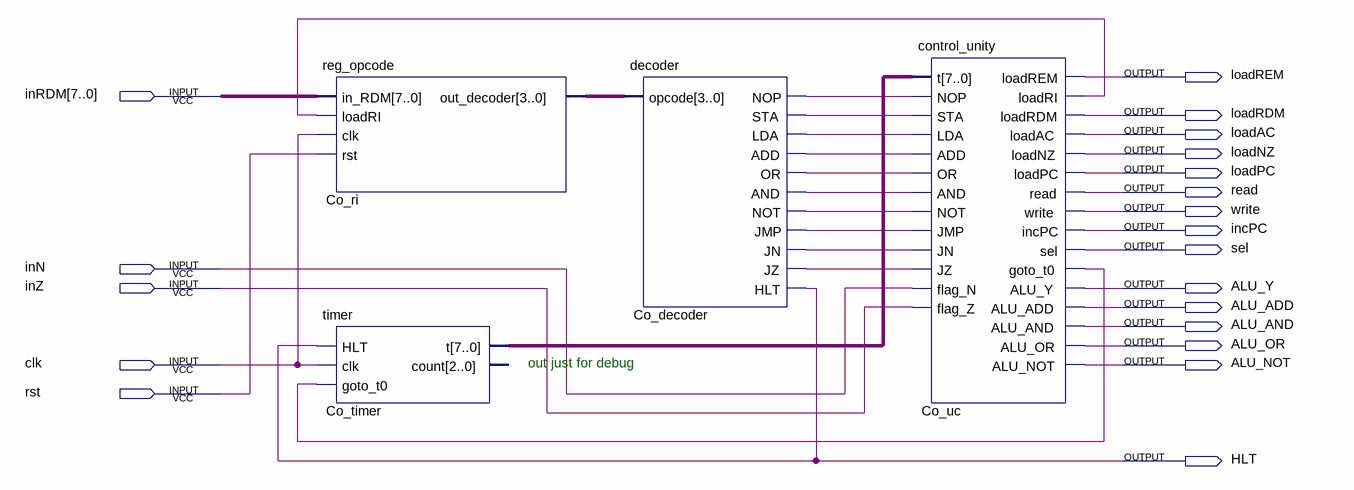
[diagram p0: schematic sheet]
// Quartus schematic mega_cu.bdf as structural Verilog: 4 symbols, 20 pins
module mega_cu (
  input  [7:0] inRDM,
  input  inN,
  input  inZ,
  input  clk,
  input  rst,
  output loadREM,
  output loadRDM,
  output loadAC,
  output loadNZ,
  output loadPC,
  output read,
  output write,
  output incPC,
  output sel,
  output ALU_Y,
  output ALU_ADD,
  output ALU_AND,
  output ALU_OR,
  output ALU_NOT,
  output HLT
);

  wire Co_decoder_add, Co_decoder_and, Co_decoder_jmp, Co_decoder_jn, Co_decoder_jz, Co_decoder_lda,
       Co_decoder_nop, Co_decoder_not, Co_decoder_or, Co_decoder_sta, Co_uc_goto_t0, Co_uc_loadri;
  wire [3:0] Co_ri_out_decoder;
  wire [7:0] Co_timer_t;

  reg_opcode Co_ri (.in_RDM(inRDM), .loadRI(Co_uc_loadri), .clk(clk), .rst(rst), .out_decoder(Co_ri_out_decoder));
  timer Co_timer (.HLT(HLT), .clk(clk), .goto_t0(Co_uc_goto_t0), .t(Co_timer_t));  // open: count
  decoder Co_decoder (
    .opcode(Co_ri_out_decoder), .NOP(Co_decoder_nop), .STA(Co_decoder_sta), .LDA(Co_decoder_lda),
    .ADD(Co_decoder_add), .OR(Co_decoder_or), .AND(Co_decoder_and), .NOT(Co_decoder_not),
    .JMP(Co_decoder_jmp), .JN(Co_decoder_jn), .JZ(Co_decoder_jz), .HLT(HLT));
  control_unity Co_uc (
    .t(Co_timer_t), .NOP(Co_decoder_nop), .STA(Co_decoder_sta), .LDA(Co_decoder_lda), .ADD(Co_decoder_add),
    .OR(Co_decoder_or), .AND(Co_decoder_and), .NOT(Co_decoder_not), .JMP(Co_decoder_jmp), .JN(Co_decoder_jn),
    .JZ(Co_decoder_jz), .flag_N(inN), .flag_Z(inZ), .loadREM(loadREM), .loadRI(Co_uc_loadri),
    .loadRDM(loadRDM), .loadAC(loadAC), .loadNZ(loadNZ), .loadPC(loadPC), .read(read), .write(write),
    .incPC(incPC), .sel(sel), .goto_t0(Co_uc_goto_t0), .ALU_Y(ALU_Y), .ALU_ADD(ALU_ADD), .ALU_AND(ALU_AND),
    .ALU_OR(ALU_OR), .ALU_NOT(ALU_NOT));

  // Notes on the sheet:
  //   out just for debug
endmodule
